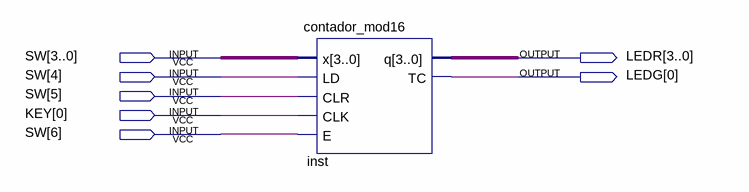
[diagram p0: schematic sheet]
// Quartus schematic contador_mod_16_TESTE.bdf as structural Verilog: 1 symbols, 7 pins
module contador_mod_16_TESTE (
  input  [6:0] SW,
  input  [0:0] KEY,
  output [3:0] LEDR,
  output [0:0] LEDG
);

  contador_mod16 inst (.x(SW[3:0]), .LD(SW[4]), .CLR(SW[5]), .CLK(KEY[0]), .E(SW[6]), .q(LEDR), .TC(LEDG[0]));
endmodule
